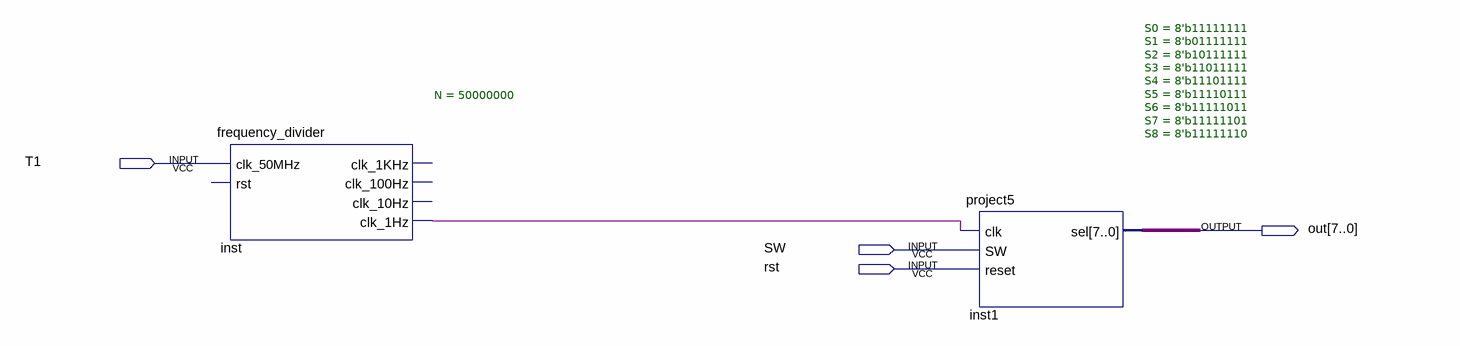
[diagram p0: schematic sheet]
// Quartus schematic project7.bdf as structural Verilog: 2 symbols, 4 pins
module project7 (
  input  T1,
  input  SW,
  input  rst,
  output [7:0] out
);

  wire inst_clk_1hz;

  frequency_divider #(.N(50000000)) inst (.clk_1Hz(inst_clk_1hz));  // open: clk_50MHz, rst, clk_1KHz, clk_100Hz, clk_10Hz
  project5 #(.S0(8'b11111111), .S1(8'b01111111), .S2(8'b10111111), .S3(8'b11011111), .S4(8'b11101111), .S5(8'b11110111), .S6(8'b11111011), .S7(8'b11111101), .S8(8'b11111110)) inst1 (
    .clk(inst_clk_1hz), .SW(SW), .reset(rst), .sel(out));
endmodule
